# EAGLE schematic attiny85 (EAGLE 9.6.2)
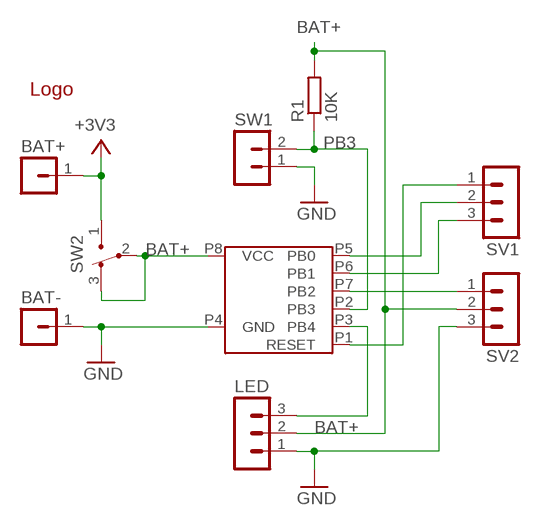
[diagram p0: schematic, sheet 1]

## Parts
ATTINY85-1  ATTINY85SOP8  [ATTINY85-20SUR]
BAT+  PINHEAD-MA01-1  [PINHEAD-MA01-1]
BAT-  PINHEAD-MA01-1  [PINHEAD-MA01-1]
LED  PINHEAD-MA03-1  [PINHEAD-MA03-1]
LOGO1  LOGO-YTLOGO2-BOTTOM  [LOGO-YT2-BOTTOM]
R1  10K  R-EU_M3216  [M3216]
SV1  PINHEAD-MA03-1  [PINHEAD-MA03-1]
SV2  PINHEAD-MA03-1  [PINHEAD-MA03-1]
SW1  PINHEAD-MA02-1  [PINHEAD-MA02-1]
SW2  SW3-1  [SW3-1]

## Nets
+3V3: BAT+.1 SW2.1
BAT+: ATTINY85-1.P8(VCC) LED.2 R1.2 SV2.2 SW2.2 SW2.3
GND: ATTINY85-1.P4(GND) BAT-.1 LED.1 SV2.3 SW1.1
N$1: ATTINY85-1.P3(PB4) LED.3
N$2: ATTINY85-1.P7(PB2) SV2.1
N$3: ATTINY85-1.P6(PB1) SV1.3
N$4: ATTINY85-1.P1(RESET) SV1.1
N$5: ATTINY85-1.P5(PB0) SV1.2
PB3: ATTINY85-1.P2(PB3) R1.1 SW1.2

## Library data of the parts
ATTINY85-1 = ytani1:ATTINY85
BAT+ BAT- = ytani1:PINHEAD-MA01-1
LED SV1 SV2 = ytani1:PINHEAD-MA03-1: PIN HEADER; OC_FARNELL: unknown; OC_NEWARK: unknown
LOGO1 = ytani1:LOGO-YT: Logo Bitmap
R1 = rcl:R-EU_: RESISTOR, European symbol; SPICEPREFIX: R
SW1 = ytani1:PINHEAD-MA02-1: PIN HEADER
SW2 = ytani1:SW3-1: Slide Switch 3x1 pin https://www.amazon.co.jp/gp/product/B01LYVYQNO/ SS12D00G3 2ポジションSPDT 1P2T 3ピン; MF: HiLetgo; URL_AMAZON: https://www.amazon.co.jp/gp/product/B01LYVYQNO/